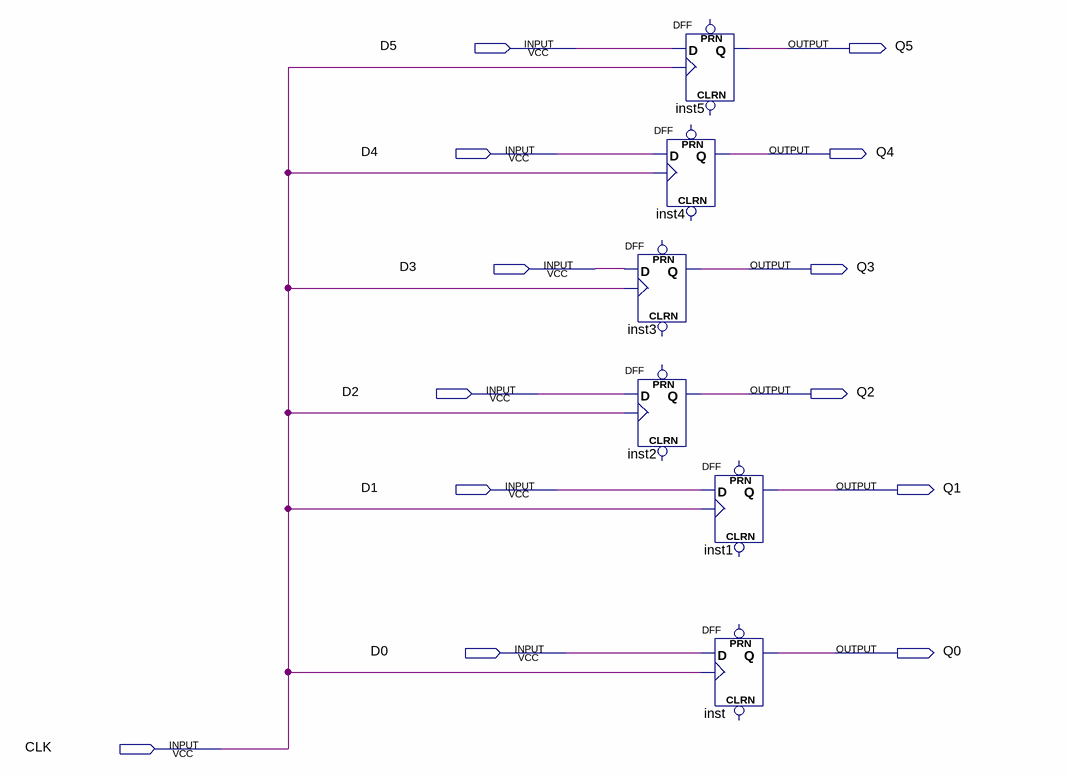
[diagram p0: schematic sheet]
// Quartus schematic ham_D_FF_6bits.bdf as structural Verilog: 6 symbols, 13 pins
module ham_D_FF_6bits (
  input  D5,
  input  D4,
  input  D3,
  input  D2,
  input  D1,
  input  D0,
  input  CLK,
  output Q5,
  output Q4,
  output Q3,
  output Q2,
  output Q1,
  output Q0
);

  DFF inst5 (.CLK(CLK), .D(D5), .Q(Q5));  // open: CLRN, PRN
  DFF inst4 (.CLK(CLK), .D(D4), .Q(Q4));  // open: CLRN, PRN
  DFF inst3 (.CLK(CLK), .D(D3), .Q(Q3));  // open: CLRN, PRN
  DFF inst2 (.CLK(CLK), .D(D2), .Q(Q2));  // open: CLRN, PRN
  DFF inst1 (.CLK(CLK), .D(D1), .Q(Q1));  // open: CLRN, PRN
  DFF inst (.CLK(CLK), .D(D0), .Q(Q0));  // open: CLRN, PRN
endmodule
